# EAGLE design Interface_board (EAGLE 9.6.2)
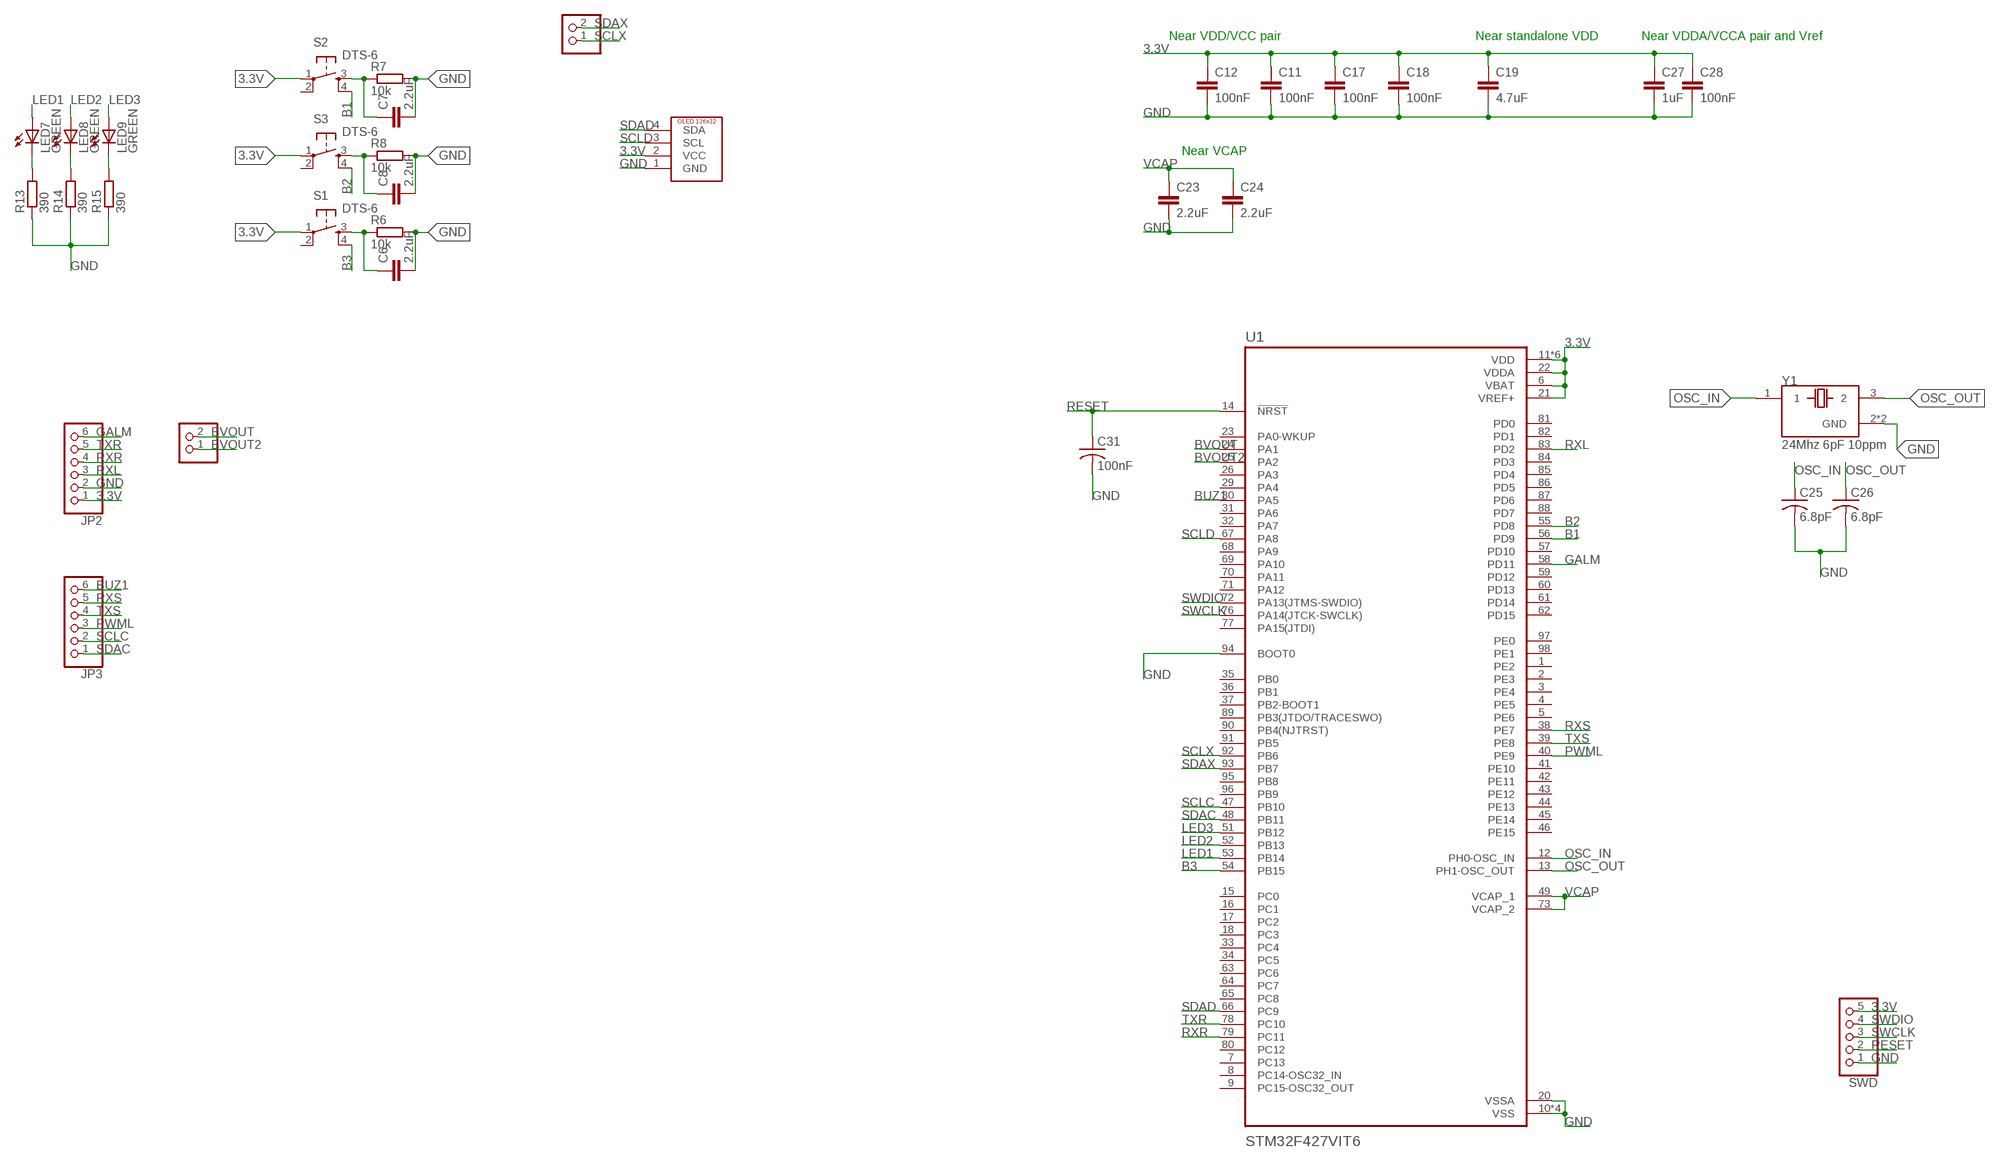
[diagram p0: schematic, sheet 1]

## Parts
C6  2.2uF  C-EUC0603  [C0603]
C7  2.2uF  C-EUC0603  [C0603]
C8  2.2uF  C-EUC0603  [C0603]
C11  100nF  C-EUC0603  [C0603]
C12  100nF  C-EUC0603  [C0603]
C17  100nF  C-EUC0603  [C0603]
C18  100nF  C-EUC0603  [C0603]
C19  4.7uF  C-EUC0603  [C0603]
C23  2.2uF  C-EUC0603  [C0603]
C24  2.2uF  C-EUC0603  [C0603]
C25  6.8pF  C-USC0603  [C0603]
C26  6.8pF  C-USC0603  [C0603]
C27  1uF  C-EUC0603  [C0603]
C28  100nF  C-EUC0603  [C0603]
C31  100nF  C-USC0603  [C0603]
JP1  PINHD-1X2  [1X02]
JP2  PINHD-1X6  [1X06]
JP3  PINHD-1X6  [1X06]
JP4  PINHD-1X2  [1X02]
LED7  GREEN  LEDCHIPLED_0603  [CHIPLED_0603]
LED8  GREEN  LEDCHIPLED_0603  [CHIPLED_0603]
LED9  GREEN  LEDCHIPLED_0603  [CHIPLED_0603]
R6  10k  R-EU_R0603  [R0603]
R7  10k  R-EU_R0603  [R0603]
R8  10k  R-EU_R0603  [R0603]
R13  390  R-EU_R0603  [R0603]
R14  390  R-EU_R0603  [R0603]
R15  390  R-EU_R0603  [R0603]
S1  DTS-6  [DTS-6]
S2  DTS-6  [DTS-6]
S3  DTS-6  [DTS-6]
SWD  PINHD-1X5/90  [1X05/90]
U1  STM32F427VIT6  [QFP50P1600X1600X160-100N]
U$1  OLED126X32THROUGH_HOLE  [OLED128X64]
Y1  24Mhz 6pF 10ppm  TSX-3225_16.0000MF18X-AC3  [XTAL_TSX-3225_16.0000MF18X-AC3]

## Nets
3.3V: C11.1 C12.1 C17.1 C18.1 C19.1 C27.1 C28.1 JP2.1 S1.1 S2.1 S3.1 SWD.5 U1.6(VBAT) U1.11(VDD) U1.19(VDD) U1.21(VREF+) U1.22(VDDA) U1.28(VDD) U1.50(VDD) U1.75(VDD) U1.100(VDD) U$1.2(VCC)
B1: S2.4 U1.56(PD9)
B2: S3.4 U1.55(PD8)
B3: S1.4 U1.54(PB15)
BUZ1: JP3.6 U1.30(PA5)
BVOUT: JP4.2 U1.24(PA1)
BVOUT2: JP4.1 U1.25(PA2)
GALM: JP2.6 U1.58(PD11)
GND: C6.2 C7.2 C8.2 C11.2 C12.2 C17.2 C18.2 C19.2 C23.2 C24.2 C25.2 C26.2 C27.2 C28.2 C31.2 JP2.2 R6.2 R7.2 R8.2 R13.1 R14.1 R15.1 SWD.1 U1.10(VSS) U1.20(VSSA) U1.27(VSS) U1.74(VSS) U1.94(BOOT0) U1.99(VSS) U$1.1(GND) Y1.2(GND) Y1.4(GND)
LED1: LED7.A U1.53(PB14)
LED2: LED8.A U1.52(PB13)
LED3: LED9.A U1.51(PB12)
N$2: C6.1 R6.1 S1.3
N$3: C7.1 R7.1 S2.3
N$4: C8.1 R8.1 S3.3
N$5: LED7.C R13.2
N$8: LED8.C R14.2
N$9: LED9.C R15.2
OSC_IN: C25.1 U1.12(PH0-OSC_IN) Y1.1
OSC_OUT: C26.1 U1.13(PH1-OSC_OUT) Y1.3
PWML: JP3.3 U1.40(PE9)
RESET: C31.1 SWD.2 U1.14(!NRST)
RXL: JP2.3 U1.83(PD2)
RXR: JP2.4 U1.79(PC11)
RXS: JP3.5 U1.38(PE7)
SCLC: JP3.2 U1.47(PB10)
SCLD: U1.67(PA8) U$1.3(SCL)
SCLX: JP1.1 U1.92(PB6)
SDAC: JP3.1 U1.48(PB11)
SDAD: U1.66(PC9) U$1.4(SDA)
SDAX: JP1.2 U1.93(PB7)
SWCLK: SWD.3 U1.76(PA14(JTCK-SWCLK))
SWDIO: SWD.4 U1.72(PA13(JTMS-SWDIO))
TXR: JP2.5 U1.78(PC10)
TXS: JP3.4 U1.39(PE8)
VCAP: C23.1 C24.1 U1.49(VCAP_1) U1.73(VCAP_2)
Unconnected: S1.2 S2.2 S3.2 U1.1(PE2) U1.2(PE3) U1.3(PE4) U1.4(PE5) U1.5(PE6) U1.7(PC13) U1.8(PC14-OSC32_IN) U1.9(PC15-OSC32_OUT) U1.15(PC0) U1.16(PC1) U1.17(PC2) U1.18(PC3) U1.23(PA0-WKUP) U1.26(PA3) U1.29(PA4) U1.31(PA6) U1.32(PA7) U1.33(PC4) U1.34(PC5) U1.35(PB0) U1.36(PB1) U1.37(PB2-BOOT1) U1.41(PE10) U1.42(PE11) U1.43(PE12) U1.44(PE13) U1.45(PE14) U1.46(PE15) U1.57(PD10) U1.59(PD12) U1.60(PD13) U1.61(PD14) U1.62(PD15) U1.63(PC6) U1.64(PC7) U1.65(PC8) U1.68(PA9) U1.69(PA10) U1.70(PA11) U1.71(PA12) U1.77(PA15(JTDI)) U1.80(PC12) U1.81(PD0) U1.82(PD1) U1.84(PD3) U1.85(PD4) U1.86(PD5) U1.87(PD6) U1.88(PD7) U1.89(PB3(JTDO/TRACESWO)) U1.90(PB4(NJTRST)) U1.91(PB5) U1.95(PB8) U1.96(PB9) U1.97(PE0) U1.98(PE1)

## Notes on the sheet
- Near VDD/VCC pair | Near standalone VDD | Near VDDA/VCCA pair and Vref
- Near VCAP

## Library data of the parts
C6-C8 C11 C12 C17-C19 C23 C24 C27 C28 = rcl:C-EU: CAPACITOR, European symbol; SPICEPREFIX: C
C25 C26 C31 = adafruit:C-US: CAPACITOR, American symbol
JP1 JP4 = pinhead:PINHD-1X2: PIN HEADER
JP2 JP3 = pinhead:PINHD-1X6: PIN HEADER
LED7-LED9 = adafruit:LED: LED OSRAM: - CHIPLED LG R971, LG N971, LY N971, LG Q971, LY Q971, LO R971, LY R971 LH N974, LH R974 LS Q976, LO Q976, LY Q976 LO Q996 - Hyper CHIPLED LW Q18S LB Q993, LB Q99A, LB R99A - SideLED LS A670, LO A670, LY A670, LG A670, LP A670 LB A673, LV A673, LT A673, LW A673 LH A674 LY A675 LS A676, LA A676, LO A676, LY A676, LW A676 LS A679, LY A679, LG A679 - Hyper Micro SIDELED® LS Y876, LA Y876, LO Y876, LY Y876 LT Y87S - SmartLED LW L88C, LW L88S LB L89C, LB L89S, LG L890 LS L89K, LO L89K, LY L89K LS L896, LA L896, LO L896, LY L896 - TOPLED LS T670, LO T670, LY T670, LG T670, LP T670 LSG T670, LSP T670, LSY T670, LOP T670, LYG T670 LG T671, LOG T671, LSG T671 LB T673, LV T673, LT T673, LW T673 LH T674 LS T676, LA T676, LO T676, LY T676, LB T676, LH T676, LSB T676, LW T676 LB T67C, LV T67C, LT T67C, LS T67K, LO T67K, LY T67K, LW E67C LS E67B, LA E67B, LO E67B, LY E67B, LB E67C, LV E67C, LT E67C LW T67C LS T679, LY T679, LG T679 LS T770, LO T770, LY T770, LG T770, LP T770 LB T773, LV T773, LT T773, LW T773 LH T774 LS E675, LA E675, LY E675, LS T675 LS T776, LA T776, LO T776, LY T776, LB T776 LHGB T686 LT T68C, LB T68C - Hyper Mini TOPLED® LB M676 - Mini TOPLED Santana® LG M470 LS M47K, LO M47K, LY M47K Source: http://www.osram.convergy.de/
R6-R8 R13-R15 = rcl:R-EU_: RESISTOR, European symbol; SPICEPREFIX: R
S1-S3 = switch-tact:DTS-6
SWD = pinhead:PINHD-1X5: PIN HEADER
U1 = STM32F427VIT6:STM32F427VIT6: None Buy Part <https://snapeda.com/parts/STM32F427VIT6/STMicroelectronics/view-part/?ref=eda> Check availability <https://pricing.snapeda.com/parts/STM32F427VIT6/STMicroelectronics/view-part?ref=eda>; AVAILABILITY: In Stock; CHECK_PRICES: https://www.snapeda.com/parts/STM32F427VIT6/STMicroelectronics/view-part/?ref=eda; DESCRIPTION: ARM® Cortex®-M4 STM32F4 Microcontroller IC 32-Bit Single-Core 180MHz 2MB (2M x 8) FLASH 100-LQFP (14x14); MF: STMicroelectronics; MP: STM32F427VIT6; PACKAGE: LQFP-100 STMicroelectronics; PRICE: None; PURCHASE-URL: https://www.snapeda.com/api/url_track_click_mouser/?unipart_id=225734&manufacturer=STMicroelectronics&part_name=STM32F427VIT6&search_term= stm32f427vit6; SNAPEDA_LINK: https://www.snapeda.com/parts/STM32F427VIT6/STMicroelectronics/view-part/?ref=snap
U$1 = OLED 128x32:OLED126X32
Y1 = SMD3225:TSX-3225_16.0000MF18X-AC3: SMD Crystal 16MHz-9pF-10ppm-60R; Check availability <https://pricing.snapeda.com/parts/TSX-3225%2016.0000MF18X-AC3/EPSON/view-part?ref=eda>; AVAILABILITY: In Stock; CHECK_PRICES: https://www.snapeda.com/parts/TSX-3225%2016.0000MF18X-AC3/EPSON/view-part/?ref=eda; DESCRIPTION: 16 MHz ±10ppm Crystal 9pF 60 Ohms 4-SMD, No Lead; MF: EPSON; MP: TSX-3225 16.0000MF18X-AC3; PACKAGE: SMD-4 EPSON; PRICE: None; PURCHASE-URL: https://www.snapeda.com/api/url_track_click_mouser/?unipart_id=105674&manufacturer=EPSON&part_name=TSX-3225 16.0000MF18X-AC3&search_term=None; SNAPEDA_LINK: https://www.snapeda.com/parts/TSX-3225%2016.0000MF18X-AC3/EPSON/view-part/?ref=snap

## Board
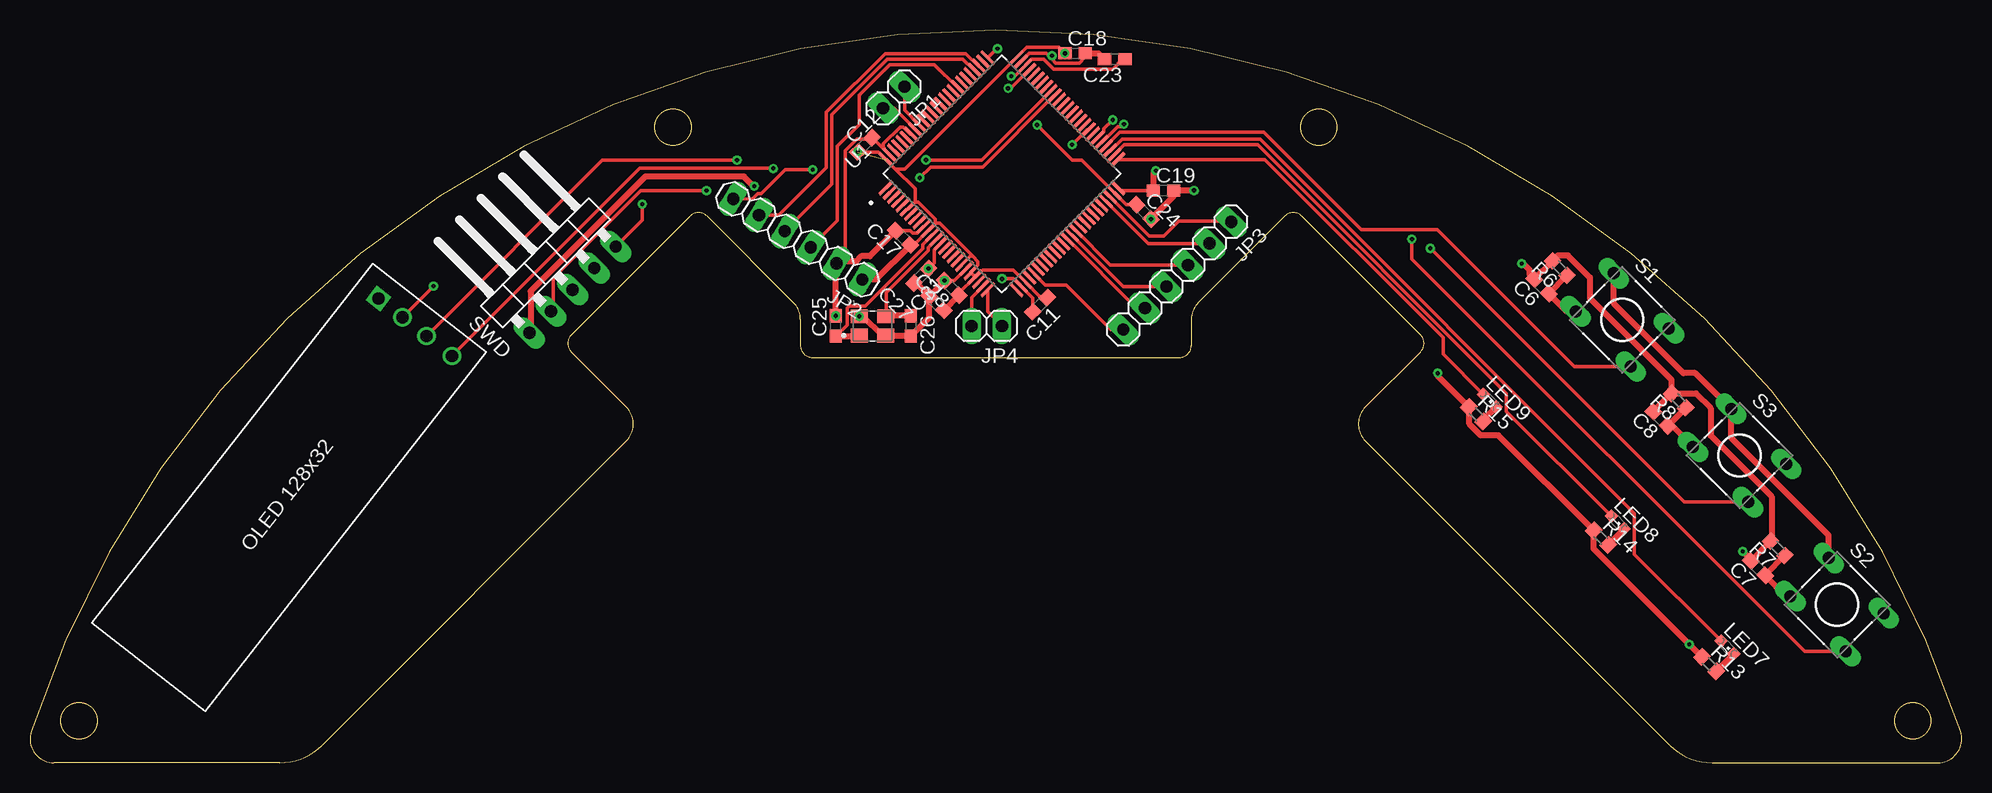
[diagram p1: board, top side]
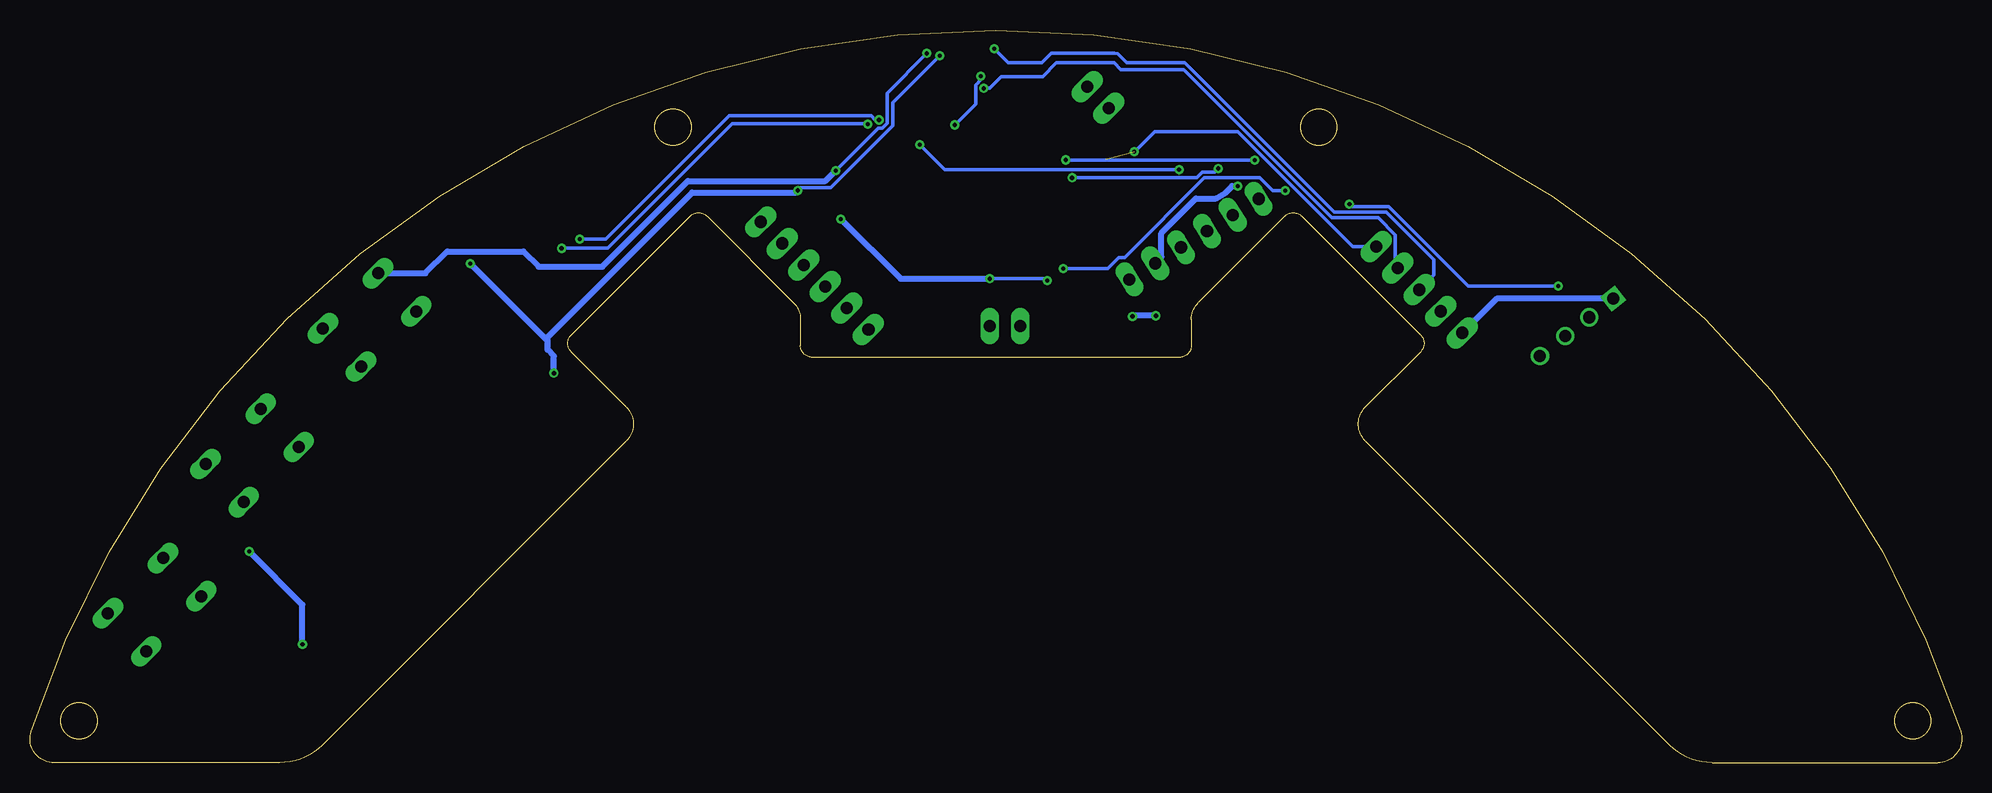
[diagram p2: board, bottom side, seen from below]

Size 160.98 x 61.1 mm. Coordinates in mm from the lower left corner, seen from the top.
Outline: 64.2,36.96 64.2,34.79 arc90 65.2,33.79 95.78,33.79 arc90 96.78,34.79 96.78,36.96 arc-45 97.37,38.38 104.56,45.57 arc-90 105.98,45.57 115.88,35.67 arc-90 115.88,34.25 111.28,29.66 arc90 111.28,26.83 136.65,1.46 arc45 140.18,0 158.98,0 arc108 160.89,2.62 arc144 0.1,2.62 arc108 2,0 20.8,0 arc45 24.34,1.46 49.7,26.83 arc90 49.7,29.66 45.11,34.25 arc-90 45.11,35.67 55.01,45.57 arc-90 56.42,45.57 63.61,38.38 arc-45 64.2,36.96
Outline: circle at 107.4,53 radius 1.5
Outline: circle at 53.59,53 radius 1.5
Outline: circle at 4.09,3.5 radius 1.5
Outline: circle at 156.89,3.5 radius 1.5
Copper layers (1*16): Top 0.035mm / dielectric 1.5mm / Bottom 0.035mm
Design rules "default": minimum track width 6mil, minimum drill 0.35mm, track to track 6mil, track to pad 6mil, pad to pad 6mil, via to via 6mil, smd to smd 6mil, copper to edge 40mil, drill to drill 6mil, minimum pad ring 10mil, minimum via ring 8mil, stop-mask expansion 4mil, vias tented up to drill 0mil, thermal gap 10mil

### Footprints (pad centres in the part's own frame; a part is rotated, then mirrored left to right if it is on the bottom)
C0603 = smd 1.1 x 1: 1 -0.85,0; 2 0.85,0
1X02 = drill 1.016 long: 1 -1.27,0; 2 1.27,0
1X06 = drill 1.016 long: 1 -6.35,0; 2 -3.81,0; 3 -1.27,0; 4 1.27,0; 5 3.81,0; 6 6.35,0
CHIPLED_0603 = smd 0.8 x 0.8: A 0,-0.75; C 0,0.75
R0603 = smd 1 x 1.1: 1 -0.85,0; 2 0.85,0
DTS-6 = drill 1 long: 1 -3.25,2.25; 2 3.25,2.25; 3 -3.25,-2.25; 4 3.25,-2.25
1X05/90 = drill 1.016 long: 1 -5.08,-3.81; 2 -2.54,-3.81; 3 0,-3.81; 4 2.54,-3.81; 5 5.08,-3.81
QFP50P1600X1600X160-100N = smd 1.56 x 0.28: 1 -7.68,6; 2 -7.68,5.5; 3 -7.68,5; 4 -7.68,4.5; 5 -7.68,4; 6 -7.68,3.5; 7 -7.68,3; 8 -7.68,2.5; 9 -7.68,2; 10 -7.68,1.5; 11 -7.68,1; 12 -7.68,0.5; 13 -7.68,0; 14 -7.68,-0.5; 15 -7.68,-1; 16 -7.68,-1.5; 17 -7.68,-2; 18 -7.68,-2.5; 19 -7.68,-3; 20 -7.68,-3.5; 21 -7.68,-4; 22 -7.68,-4.5; 23 -7.68,-5; 24 -7.68,-5.5; 25 -7.68,-6; 51 7.68,-6; 52 7.68,-5.5; 53 7.68,-5; 54 7.68,-4.5; 55 7.68,-4; 56 7.68,-3.5; 57 7.68,-3; 58 7.68,-2.5; 59 7.68,-2; 60 7.68,-1.5; 61 7.68,-1; 62 7.68,-0.5; 63 7.68,0; 64 7.68,0.5; 65 7.68,1; 66 7.68,1.5; 67 7.68,2; 68 7.68,2.5; 69 7.68,3; 70 7.68,3.5; 71 7.68,4; 72 7.68,4.5; 73 7.68,5; 74 7.68,5.5; 75 7.68,6 | smd 0.28 x 1.56: 26 -6,-7.68; 27 -5.5,-7.68; 28 -5,-7.68; 29 -4.5,-7.68; 30 -4,-7.68; 31 -3.5,-7.68; 32 -3,-7.68; 33 -2.5,-7.68; 34 -2,-7.68; 35 -1.5,-7.68; 36 -1,-7.68; 37 -0.5,-7.68; 38 0,-7.68; 39 0.5,-7.68; 40 1,-7.68; 41 1.5,-7.68; 42 2,-7.68; 43 2.5,-7.68; 44 3,-7.68; 45 3.5,-7.68; 46 4,-7.68; 47 4.5,-7.68; 48 5,-7.68; 49 5.5,-7.68; 50 6,-7.68; 76 6,7.68; 77 5.5,7.68; 78 5,7.68; 79 4.5,7.68; 80 4,7.68; 81 3.5,7.68; 82 3,7.68; 83 2.5,7.68; 84 2,7.68; 85 1.5,7.68; 86 1,7.68; 87 0.5,7.68; 88 0,7.68; 89 -0.5,7.68; 90 -1,7.68; 91 -1.5,7.68; 92 -2,7.68; 93 -2.5,7.68; 94 -3,7.68; 95 -3.5,7.68; 96 -4,7.68; 97 -4.5,7.68; 98 -5,7.68; 99 -5.5,7.68; 100 -6,7.68
OLED128X64 = drill 1.016 square: 1 2,2.19 | drill 1.016: 2 2,4.73; 3 2,7.27; 4 2.009,9.961
XTAL_TSX-3225_16.0000MF18X-AC3 = smd 1.4 x 1.15: 1 -1.1,-0.8; 2 1.1,-0.8; 3 1.1,0.8; 4 -1.1,0.8

### Placement (x,y rotation side)
C6  125.96,39.72 135 top
C7  143.99,16.22 135 top
C8  135.86,28.67 135 top
C11  84.17,38.19 225 top
C12  69.57,51.53 45 top
C17  72.74,43.78 135 top
C18  87.1,59.15 0 top
C19  94.46,47.72 0 top
C23  90.4,58.64 180 top
C24  92.81,45.94 315 top
C25  67.16,36.41 90 top
C26  73.38,36.41 270 top
C27  75.54,38.32 135 top
C28  76.81,39.59 135 top
C31  74.27,40.6 225 top
JP1  71.98,55.46 225 top
JP2  63.98,43.65 148 top
JP3  95.6,40.6 225 top
JP4  79.73,36.41 180 top
LED7  141.45,9.62 225 top
LED8  132.31,20.03 225 top
LED9  121.64,30.19 225 top
R6  127.48,41.24 135 top
R7  145.64,17.87 135 top
R8  137.39,30.19 135 top
R13  139.93,8.22 315 top
R14  130.91,18.76 315 top
R15  120.5,29.05 315 top
S1  132.69,36.92 315 top
S2  150.6,13.17 315 top
S3  142.47,25.62 315 top
SWD  42.52,42.13 45 top
U1  81,49.11 45 top
U$1  28.55,41.62 232 top
Y1  70.2,36.41 0 top

### Tracks (layer width: path | path; a pad name or v marks a point on that pad's centre or on a via)
3.3V  (via drill 0.35)  (1 unrouted)
  Top 0.305: U1.22 U1.21 78.4,40.92 78.98,41.5 78.98,41.8 78.56,42.23 | U1.22 77.41,39.16 C28.1 | U1.19 78.36,42.23 78.56,42.23 | 75.51,44.98 74.92,44.39 U1.11 73.65,43.18 C17.1 | 75.51,44.98 75.81,44.98 78.56,42.23 | U1.6 73.17,46.16 73.76,46.75 | 75.51,44.98 75.45,45.04 75.45,45.34 74.04,46.75 73.76,46.75 | U1.22 78.83,40.5 79.42,41.09 81.95,41.09 U1.28 84.25,38.79 C11.1 | C19.1 90.88,47.72 U1.50 | C18.1 85.74,59.65 83.06,59.65 U1.75 72.91,49.51 72.12,49.51 | 72.12,49.51 70.7,50.93 C12.1 v68.97,50.94 | 72.12,49.51 73.76,47.87 73.76,46.75 | SWD.5 51.03,45.25 v51.03,46.59 | v33.63,39.73 31.01,37.11 U$1.2
  Top 0.508: S2.1 149.89,18.97 141.76,27.09 S3.1 138.78,32.49 137.77,32.49 131.98,38.28 S1.1 | v93.83,49.37 93.61,49.15 C19.1 | JP2.1 70.53,40.33 73.35,43.14 C17.1 | C27.1 C28.1
  Bottom 0.305: v93.83,49.37 90.28,52.91 89.95,52.91 89.55,53.31 89.55,55.84 C18.1 | SWD.5 50.73,43.03 60.34,52.63 67.26,52.63 68.71,51.18 | 68.71,51.18 C12.1 | 68.71,51.18 68.73,51.18 v68.97,50.94 | v51.03,46.59 50.8,46.36 47.76,46.36 41.13,39.73 v33.63,39.73
  Bottom 0.508: S1.1 128.04,40.81 126.21,42.64 119.86,42.64 118.59,41.37 113.29,41.37 106.16,48.5 94.69,48.5 v93.83,49.37
  other vias: 86.25,59.15
B1  (via drill 0.35)
  Top 0.305: S2.4 147.88,9.28 115.16,42 v115.16,43.65 | v90.23,53.6 89.49,52.85 89.49,52.61 88.95,52.07 U1.56
  Bottom 0.305: v90.23,53.6 90.54,53.6 90.88,53.93 102.72,53.93 113,43.65 v115.16,43.65
B2  (via drill 0.35)
  Top 0.305: S3.4 137.85,21.73 v116.69,42.89 | v91.16,53.25 90.93,53.03 90.63,53.03 89.32,51.72 U1.55
  Bottom 0.305: v116.69,42.89 112.85,42.89 102.45,53.29 91.19,53.29 v91.16,53.25
B3
  Top 0.305: S1.4 128.7,33.03 117.27,44.46 110.93,44.46 102.82,52.57 90.82,52.57 U1.54
BUZ1
  Top 0.305: U1.30 84.62,39.84 86.33,39.84 90.06,36.11 JP3.6
BVOUT
  Top 0.305: JP4.2 78.46,38.8 U1.24
BVOUT2
  Top 0.305: JP4.1 79.81,37.6 U1.25
GALM  (via drill 0.35)
  Top 0.305: JP2.6 60.21,46.98 60.66,47.44 60.92,47.44 62.94,49.45 v65.22,49.45 | U1.58 88.12,52.78 87.53,52.19 87.5,52.19 v86.84,51.53
  Bottom 0.305: v65.22,49.45 84.77,49.45 v86.84,51.53
GND  (via drill 0.35)
  Top 0.305: U1.20 77.03,40.19 C28.2 | C17.2 73.34,44.38 73.56,44.16 73.92,44.16 U1.10 | 81.29,40.35 v81,40.35 81.56,40.35 81.59,40.38 81.95,40.38 U1.27 83.57,38.76 C11.2 | U1.74 83.25,59.15 84.68,59.15 85.13,58.7 | 85.13,58.7 85.49,58.34 87.43,58.34 87.95,58.86 C18.2 | 71.19,51.11 C12.2 70.02,51.97 68.88,51.97 67.92,51.02 67.92,42.35 67.36,41.79 67.16,41.59 | 71.19,51.11 71.64,50.65 U1.99 | U1.94 73.37,52.42 72.78,53.01 72.5,53.01 71.09,51.6 71.09,51.32 71.19,51.23 71.19,51.11 | v85.16,58.95 85.16,58.74 85.13,58.7
  Top 0.508: C8.2 R8.2 | R8.2 136.79,31.93 129.99,38.73 129.99,40.46 128.16,42.3 127.34,42.3 R6.2 C6.2 124.94,40.73 124.94,41.11 124.43,41.62 v124.31,41.62 | R8.2 138.82,30.79 140.05,29.56 140.05,27.27 145.13,22.19 145.13,18.57 R7.2 C7.2 143.39,16.95 v142.72,17.62 | R13.1 v138.28,9.87 | v138.28,9.87 | v138.28,9.87 130.31,17.84 R14.1 122.37,27.3 120.89,27.3 119.95,28.24 119.95,29.6 R15.1 117.32,32.22 v117.32,32.48 | v97,47.72 C19.2 95.31,47.24 C24.2 | Y1.4 69.45,37.21 71.05,35.61 Y1.2 71.35,35.56 C26.2 74.94,37.12 C27.2 | C25.2 67.16,41.59 JP2.2 | v60.35,48.09 60.28,48.09 59.49,48.88 51.28,48.88 41.71,39.31 41.71,35.93 SWD.1 | C27.2 C28.2 | C27.2 73.85,40 C31.2 | C18.2 89.04,59.15 C23.2 | C17.2 69.98,42.22 69.27,42.22 68.84,41.79 67.36,41.79
  Bottom 0.305: v81,40.35 76.37,40.35 C28.2 | v97,47.72 96.78,47.94 94.27,47.94 89.09,53.12 89.09,55.02 v85.16,58.95
  Bottom 0.508: v138.28,9.87 138.28,13.17 v142.72,17.62 | v117.32,32.48 117.32,33.9 117.85,34.44 117.85,35.17 | v124.31,41.62 117.85,35.17 | 117.85,35.17 117.85,35.49 105.8,47.55 97.17,47.55 v97,47.72 | C24.2 88.42,40.35 v81,40.35 | v60.35,48.09 60.8,48.09 61.34,47.55 62.16,47.04 63.83,47.04 66.71,44.15 66.71,42.17 JP2.2 | U$1.1 38.77,38.69 SWD.1 | C25.2 69.05,37.26 Y1.4
  other vias: 76.21,40.19 93.41,45.34 67.16,37.26 69.1,37.21
LED1
  Top 0.305: U1.53 90.03,51.01 91,51.98 102.51,51.98 133.71,20.78 133.71,17.36 LED7.A
LED2
  Top 0.305: LED8.A 123.04,29.3 123.04,30.8 102.32,51.53 91.19,51.53 U1.52
LED3
  Top 0.305: LED9.A 117.75,34.08 117.75,35.45 102.9,50.3 U1.51
N$2
  Top 0.508: R6.1 C6.1 128.04,37.63 S1.3
N$3
  Top 0.508: S2.3 146.33,13.88 C7.1 R7.1
N$4
  Top 0.508: R8.1 C8.1 136.84,28.07 S3.3
N$5
  Top 0.508: R13.2 141.98,9.07 LED7.C
N$8
  Top 0.508: LED8.C 131.51,18.17 R14.2
N$9
  Top 0.508: 120.96,28.45 R15.2 121.1,28.59 LED9.C
OSC_IN
  Top 0.305: C25.1 68.1,36.51 68.1,37.91 68.28,38.09 69.6,38.09 74.39,42.89 74.39,43.21 U1.12
  Top 0.508: C25.1 69.05,35.56 Y1.1
OSC_OUT
  Top 0.305: U1.13 74.85,42.96 74.85,42.7 71.35,39.2 71.35,37.26
  Top 0.508: C26.1 71.35,37.26 Y1.3
PWML
  Top 0.305: U1.40 90.02,41.5 JP3.3
RESET  (via drill 0.35)
  Top 0.305: C31.1 75.34,41.67 75.34,42.74 U1.14 | SWD.2 43.61,37.83 43.61,40.42 50.89,47.7 v56.38,47.7
  Bottom 0.305: v56.38,47.7 57.43,47.7 58.5,48.77 63.12,48.77 69.77,42.11 70.26,42.11 71.17,41.21 C31.1
  other vias: 74.87,41.21
RXL
  Top 0.305: U1.83 77.26,56.31 75.35,58.22 71.65,58.22 69.1,55.67 69.1,53.21 67.29,51.4 67.29,45.21 JP2.3
RXR
  Top 0.305: U1.79 78.67,57.73 77.72,58.68 71.46,58.68 66.83,54.05 66.83,48.25 JP2.4
RXS
  Top 0.305: JP3.5 92.2,37.91 U1.38
SCLC
  Top 0.305: U1.47 93.18,43.3 JP3.2
SCLD  (via drill 0.35)
  Top 0.305: U1.67 79.32,50.26 v74.66,50.26 | v58.92,50.24 47.71,50.24 U$1.3
  Bottom 0.305: v58.92,50.24 58.93,50.26 v74.66,50.26
SCLX
  Top 0.305: U1.92 72.88,54.4 JP1.1
SDAC
  Top 0.305: U1.48 93.28,43.91 94.46,43.91 95.73,45.18 100.01,45.18 JP3.1
SDAD  (via drill 0.35)
  Top 0.305: v61.95,49.55 61.94,49.56 50.81,49.56 U$1.4 | v74.14,48.77 75.05,49.68 79.38,49.68 85.31,55.6 U1.66
  Bottom 0.305: v61.95,49.55 62.27,49.23 63.3,49.23 63.76,48.77 v74.14,48.77
SDAX
  Top 0.305: U1.93 72.01,54.57 JP1.2
SWCLK  (via drill 0.35)
  Top 0.305: v80.62,59.53 80.55,59.53 U1.76
  Bottom 0.305: v80.62,59.53 79.45,58.35 76.68,58.35 75.88,59.15 70.62,59.15 70.34,59.1 69.59,58.35 64.76,58.35 52.32,45.9 47.95,45.9 44.01,41.96 44.01,40.64 SWD.3
SWDIO  (via drill 0.35)
  Top 0.305: v81.51,56.23 81.75,56.23 U1.72
  Bottom 0.305: v81.51,56.23 81,56.23 80.03,57.19 76.61,57.19 75.45,58.35 70.63,58.35 70.07,57.79 64.85,57.79 52.5,45.44 48.64,45.44 47.2,44.01 47.2,41.42 SWD.4
TXR
  Top 0.305: U1.78 79.04,58.08 77.99,59.14 71.27,59.14 66.37,54.24 66.37,49.63 62.39,45.65 JP2.5
TXS
  Top 0.305: U1.39 91.11,39.71 JP3.4
VCAP  (via drill 0.35)
  Top 0.305: C24.1 91.35,46.54 U1.49 87.63,50.26 86.84,50.26 v83.92,53.18 | C23.1 91.03,58.64 90.22,57.83 85.32,57.83 84.48,58.67 83.48,58.67 U1.73 82.06,57.24 v81.76,57.24
  Bottom 0.305: v81.76,57.24 81.76,56.94 82.19,56.51 82.19,54.91 v83.92,53.18